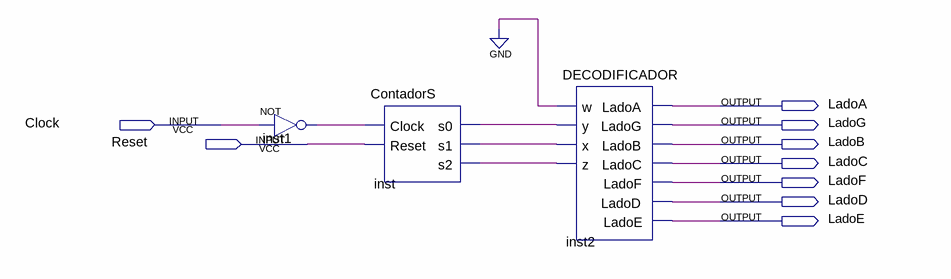
[diagram p0: schematic sheet]
// Quartus schematic Exe2.bdf as structural Verilog: 3 symbols, 9 pins
module Exe2 (
  input  Clock,
  input  Reset,
  output LadoA,
  output LadoG,
  output LadoB,
  output LadoC,
  output LadoF,
  output LadoD,
  output LadoE
);

  wire inst1_out, inst_s0, inst_s1, inst_s2;

  not inst1 (inst1_out, Clock);
  ContadorS inst (.Clock(inst1_out), .Reset(Reset), .s0(inst_s0), .s1(inst_s1), .s2(inst_s2));
  DECODIFICADOR inst2 (
    .w(1'b0), .y(inst_s0), .x(inst_s1), .z(inst_s2), .LadoA(LadoA), .LadoG(LadoG), .LadoB(LadoB),
    .LadoC(LadoC), .LadoF(LadoF), .LadoD(LadoD), .LadoE(LadoE));
endmodule
